# Altium schematic sheet ISP.SchDoc
size A4; SheetNumber: 7; SheetTotal: 8
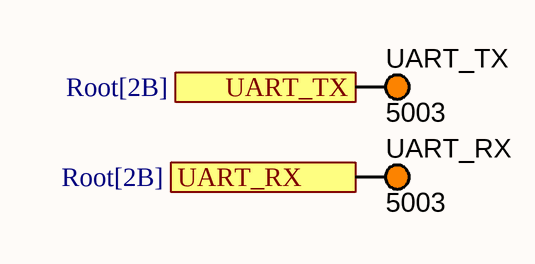
[diagram p0: ISP.SchDoc]

## Parts
UART_RX  5003  [KSTN-5003]
UART_TX  5003  [KSTN-5003]

## Ports
UART_RX (see Root[2B]), UART_TX (in, see Root[2B])

## Nets
UART_RX: UART_RX.1 ; port UART_RX
UART_TX: UART_TX.1 ; port UART_TX

## Library data of the parts
UART_RX UART_TX = CMP-002-00037-2: Test Point, Orange, Height 4.6 mm, Tail Length 3 mm, 1-Pin THD, RoHS; Manufacturer: Keystone; Colour: Orange; Packaging: Bulk; Package Description: 1-Pin Through Hole Device, Dia 2.54 mm; Pins: 1; Package Reference: 5003; Datasheet Version: Jun-15; Case/Package: 5003; Mounting Technology: TH; Connector Type: TestPoint; Diameter: 2.54mm; Contact Material: Bronze; Datasheet URL: http://keyelco.com/userAssets/file/M65p56.pdf; Manufacturer URL: http://www.keyelco.com/; Package Quantity: 10; Contact Plating: Tin; RoHS Compliant: True